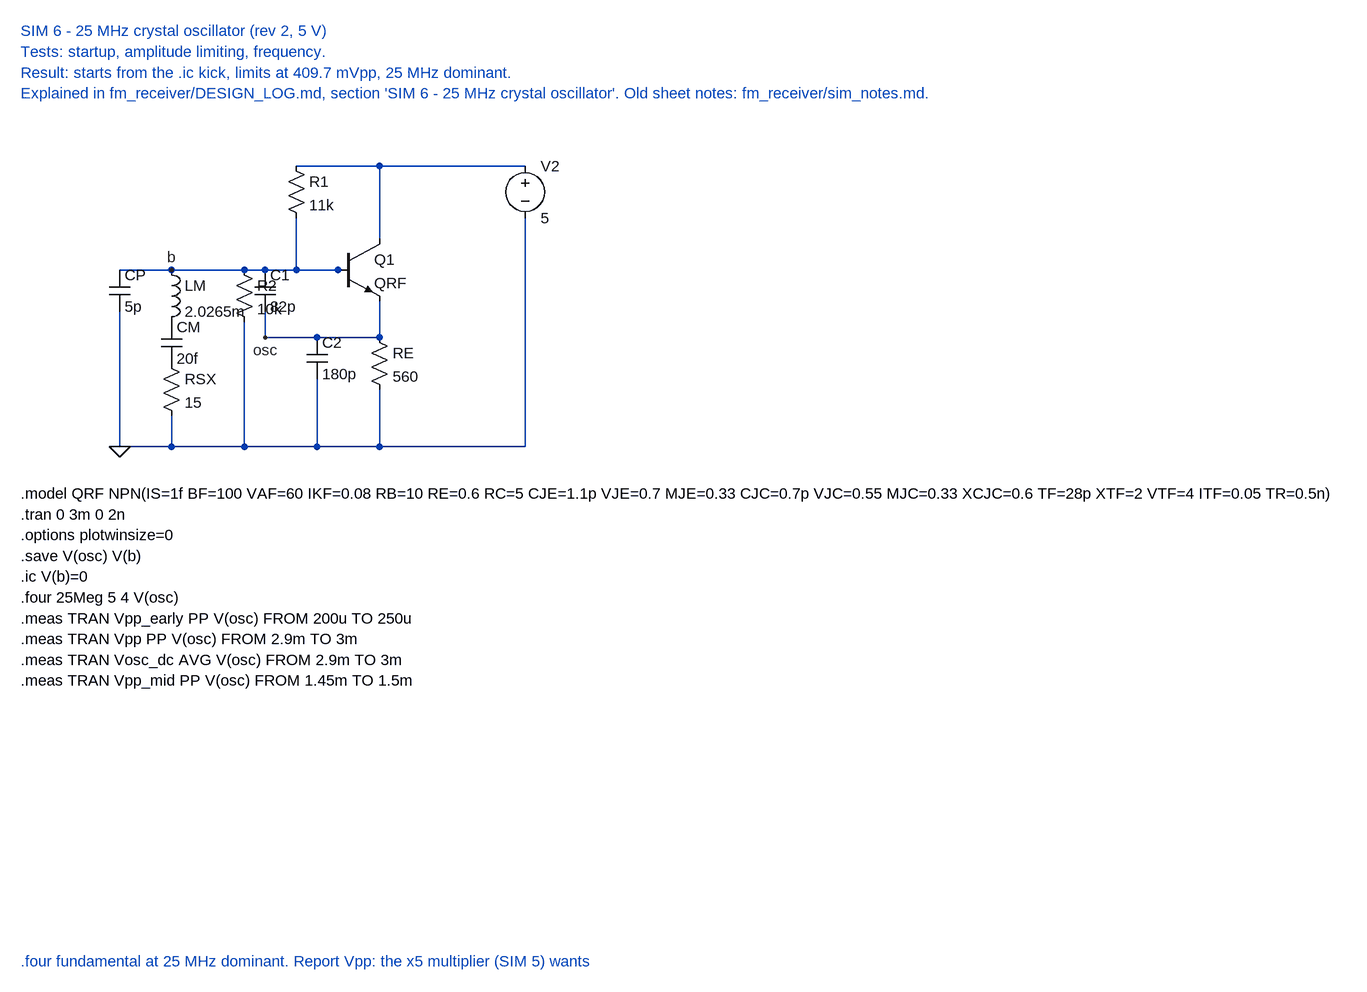
[diagram p0: schematic sim6_xtal_oscillator.asc]
sim6_xtal_oscillator.asc, the LTspice schematic file:
Version 4
SHEET 1 1200 780
WIRE 304 176 224 176
WIRE 416 176 304 176
WIRE 448 176 416 176
WIRE 496 176 448 176
WIRE 576 176 496 176
WIRE 624 128 624 16
WIRE 624 16 848 16
WIRE 496 16 624 16
WIRE 496 96 496 176
WIRE 448 240 448 280
WIRE 528 280 448 280
WIRE 624 280 528 280
WIRE 624 224 624 280
WIRE 224 240 224 448
WIRE 304 400 304 448
WIRE 416 256 416 448
WIRE 528 344 528 448
WIRE 624 360 624 448
WIRE 848 96 848 448
WIRE 304 448 224 448
WIRE 416 448 304 448
WIRE 528 448 416 448
WIRE 624 448 528 448
WIRE 848 448 624 448
FLAG 224 448 0
FLAG 448 280 osc
FLAG 304 176 b
SYMBOL voltage 848 0 R0
SYMATTR InstName V2
SYMATTR Value 5
SYMBOL res 480 0 R0
SYMATTR InstName R1
SYMATTR Value 11k
SYMBOL res 400 160 R0
SYMATTR InstName R2
SYMATTR Value 10k
SYMBOL npn 560 128 R0
SYMATTR InstName Q1
SYMATTR Value QRF
SYMBOL ind 288 160 R0
SYMATTR InstName LM
SYMATTR Value 2.0265m
SYMBOL cap 288 256 R0
SYMATTR InstName CM
SYMATTR Value 20f
SYMBOL res 288 304 R0
SYMATTR InstName RSX
SYMATTR Value 15
SYMBOL cap 208 176 R0
SYMATTR InstName CP
SYMATTR Value 5p
SYMBOL cap 432 176 R0
SYMATTR InstName C1
SYMATTR Value 82p
SYMBOL cap 512 280 R0
SYMATTR InstName C2
SYMATTR Value 180p
SYMBOL res 608 264 R0
SYMATTR InstName RE
SYMATTR Value 560
TEXT 72 520 Left 2 !.model QRF NPN(IS=1f BF=100 VAF=60 IKF=0.08 RB=10 RE=0.6 RC=5 CJE=1.1p VJE=0.7 MJE=0.33 CJC=0.7p VJC=0.55 MJC=0.33 XCJC=0.6 TF=28p XTF=2 VTF=4 ITF=0.05 TR=0.5n)
TEXT 72 552 Left 2 !.tran 0 3m 0 2n
TEXT 72 584 Left 2 !.options plotwinsize=0
TEXT 72 616 Left 2 !.save V(osc) V(b)
TEXT 72 648 Left 2 !.ic V(b)=0
TEXT 72 680 Left 2 !.four 25Meg 5 4 V(osc)
TEXT 72 712 Left 2 !.meas TRAN Vpp_early PP V(osc) FROM 200u TO 250u
TEXT 72 744 Left 2 !.meas TRAN Vpp PP V(osc) FROM 2.9m TO 3m
TEXT 72 776 Left 2 !.meas TRAN Vosc_dc AVG V(osc) FROM 2.9m TO 3m
TEXT 72 808 Left 2 !.meas TRAN Vpp_mid PP V(osc) FROM 1.45m TO 1.5m
TEXT 72 1240 Left 2 ;.four fundamental at 25 MHz dominant. Report Vpp: the x5 multiplier (SIM 5) wants
TEXT 72 -192 Left 2 ;SIM 6 - 25 MHz crystal oscillator (rev 2, 5 V)
TEXT 72 -160 Left 2 ;Tests: startup, amplitude limiting, frequency.
TEXT 72 -128 Left 2 ;Result: starts from the .ic kick, limits at 409.7 mVpp, 25 MHz dominant.
TEXT 72 -96 Left 2 ;Explained in fm_receiver/DESIGN_LOG.md, section 'SIM 6 - 25 MHz crystal oscillator'. Old sheet notes: fm_receiver/sim_notes.md.

The netlist it stands for:
* sim6_xtal_oscillator.asc
V2 N001 0 5
R1 N001 b 11k
R2 b 0 10k
Q1 N001 b osc 0 QRF
LM b P001 2.0265m
CM P001 P002 20f
RSX P002 0 15
CP b 0 5p
C1 b osc 82p
C2 osc 0 180p
RE osc 0 560
.model NPN NPN
.model PNP PNP
.lib standard.bjt
.model QRF NPN(IS=1f BF=100 VAF=60 IKF=0.08 RB=10 RE=0.6 RC=5 CJE=1.1p VJE=0.7 MJE=0.33 CJC=0.7p VJC=0.55 MJC=0.33 XCJC=0.6 TF=28p XTF=2 VTF=4 ITF=0.05 TR=0.5n)
.tran 0 3m 0 2n
.options plotwinsize=0
.save V(osc) V(b)
.ic V(b)=0
.four 25Meg 5 4 V(osc)
.meas TRAN Vpp_early PP V(osc) FROM 200u TO 250u
.meas TRAN Vpp PP V(osc) FROM 2.9m TO 3m
.meas TRAN Vosc_dc AVG V(osc) FROM 2.9m TO 3m
.meas TRAN Vpp_mid PP V(osc) FROM 1.45m TO 1.5m
* .four fundamental at 25 MHz dominant. Report Vpp: the x5 multiplier (SIM 5) wants
* SIM 6 - 25 MHz crystal oscillator (rev 2, 5 V)
* Tests: startup, amplitude limiting, frequency.
* Result: starts from the .ic kick, limits at 409.7 mVpp, 25 MHz dominant.
* Explained in fm_receiver/DESIGN_LOG.md, section 'SIM 6 - 25 MHz crystal oscillator'. Old sheet notes: fm_receiver/sim_notes.md.
.backanno
.end